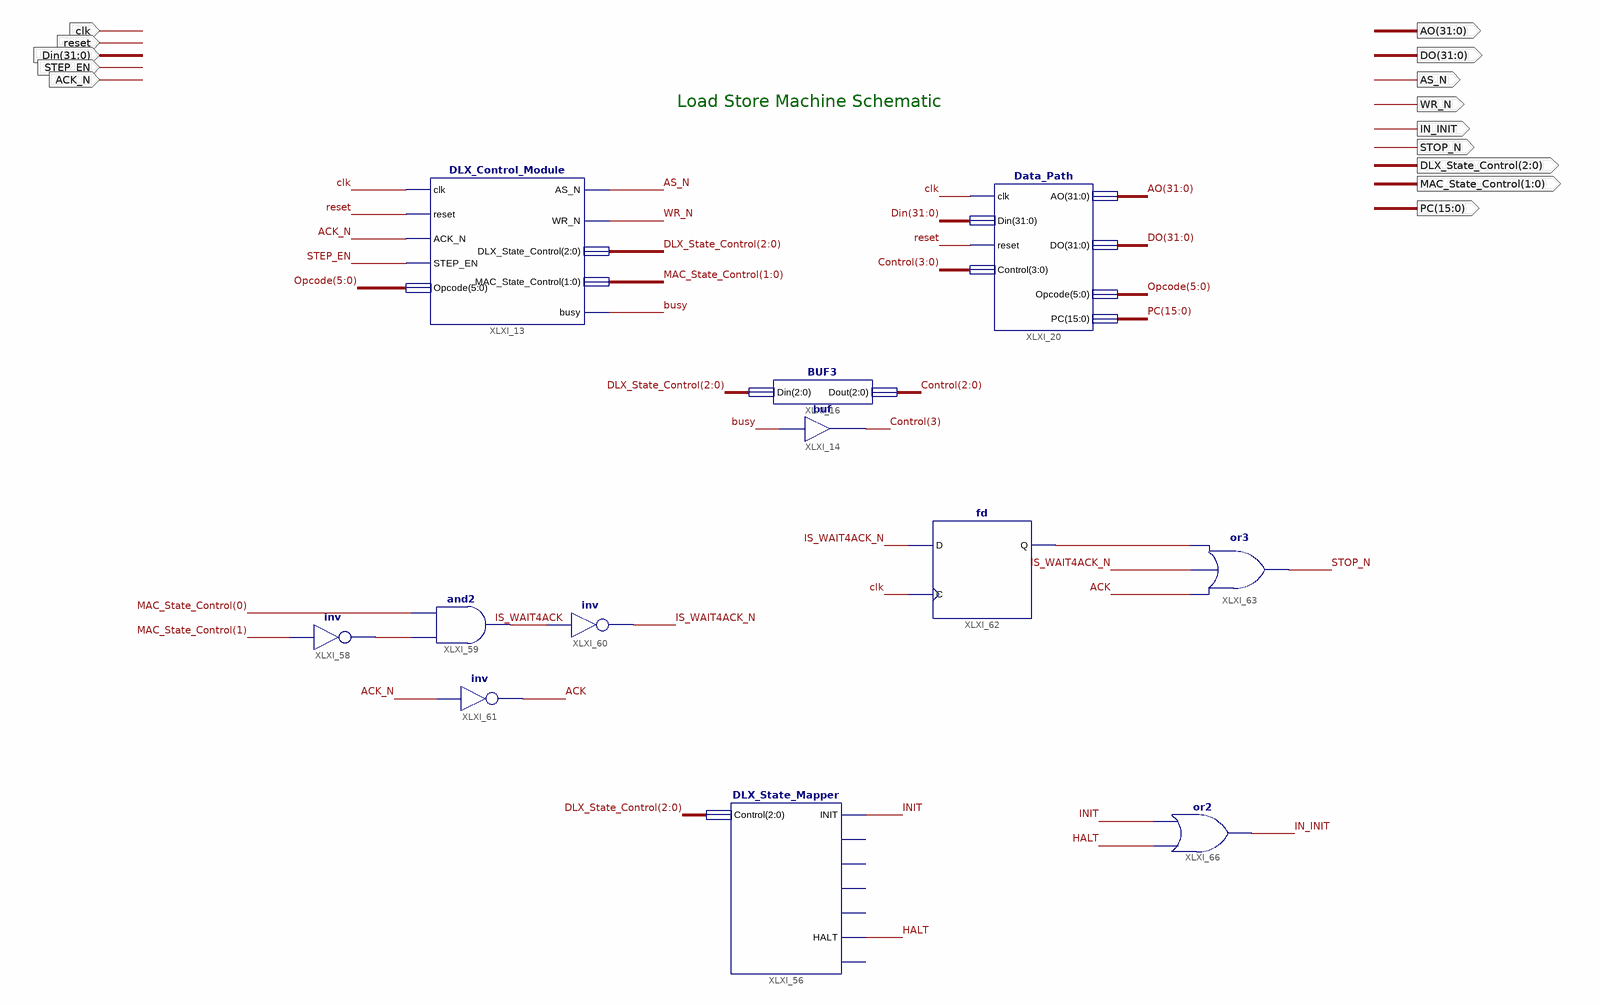
[diagram p0: schematic sheet 1]
// Xilinx ISE schematic Store_Load_Machine.sch (spartan6) as structural Verilog: 12 symbols, 14 ports
module Store_Load_Machine (
  input  clk,
  input  reset,
  input  [31:0] Din,
  input  STEP_EN,
  input  ACK_N,
  output [31:0] AO,
  output [31:0] DO,
  output AS_N,
  output WR_N,
  output [2:0] DLX_State_Control,
  output [1:0] MAC_State_Control,
  output IN_INIT,
  output STOP_N,
  output [15:0] PC
);

  wire ACK, busy, HALT, INIT, IS_WAIT4ACK, IS_WAIT4ACK_N, XLXN_130, XLXN_139;
  wire [3:0] Control;
  wire [5:0] Opcode;

  DLX_Control_Module XLXI_13 (
    .clk(clk), .reset(reset), .ACK_N(ACK_N), .STEP_EN(STEP_EN), .Opcode(Opcode), .AS_N(AS_N), .WR_N(WR_N),
    .DLX_State_Control(DLX_State_Control), .MAC_State_Control(MAC_State_Control), .busy(busy));
  Data_Path XLXI_20 (
    .clk(clk), .Din(Din), .reset(reset), .Control(Control), .AO(AO), .DO(DO), .Opcode(Opcode), .PC(PC));
  buf XLXI_14 (Control[3], busy);
  BUF3 XLXI_16 (.Din(DLX_State_Control), .Dout(Control[2:0]));
  or XLXI_66 (IN_INIT, HALT, INIT);
  fd XLXI_62 (.C(clk), .D(IS_WAIT4ACK_N), .Q(XLXN_139));
  or XLXI_63 (STOP_N, ACK, IS_WAIT4ACK_N, XLXN_139);
  not XLXI_58 (XLXN_130, MAC_State_Control[1]);
  and XLXI_59 (IS_WAIT4ACK, XLXN_130, MAC_State_Control[0]);
  not XLXI_60 (IS_WAIT4ACK_N, IS_WAIT4ACK);
  not XLXI_61 (ACK, ACK_N);
  DLX_State_Mapper XLXI_56 (
    .Control(DLX_State_Control), .INIT(INIT), .HALT(HALT));  // open: FETCH, DECODE, LOAD, STORE, WRITE_BACK

  // Notes on the sheet:
  //   Load Store Machine Schematic
endmodule
